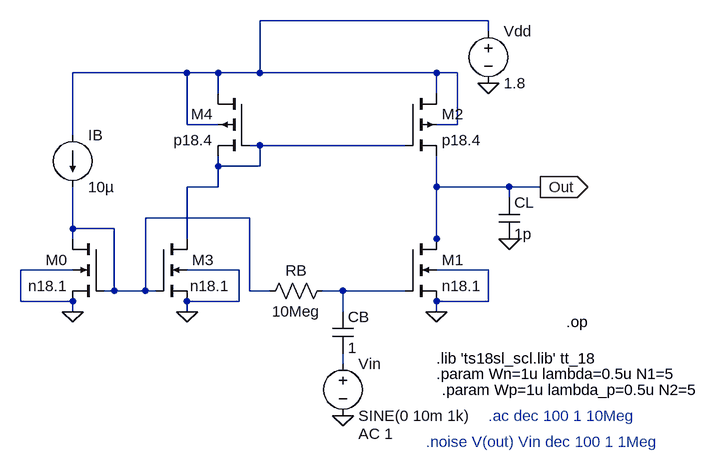
[diagram p0: schematic Q4_copy_1.asc]
Q4_copy_1.asc, the LTspice schematic file:
Version 4.1
SHEET 1 884 680
WIRE 464 -96 112 -96
WIRE 464 -80 464 -96
WIRE 0 -16 -176 -16
WIRE 48 -16 0 -16
WIRE 112 -16 112 -96
WIRE 112 -16 48 -16
WIRE 384 -16 112 -16
WIRE 416 -16 384 -16
WIRE 48 16 48 -16
WIRE 384 16 384 -16
WIRE 0 64 0 -16
WIRE 48 64 0 64
WIRE 416 64 416 -16
WIRE 416 64 384 64
WIRE -176 80 -176 -16
WIRE 112 96 96 96
WIRE 336 96 112 96
WIRE 48 128 48 112
WIRE 112 128 112 96
WIRE 112 128 48 128
WIRE 48 160 48 128
WIRE 48 160 0 160
WIRE 384 160 384 112
WIRE 496 160 384 160
WIRE 544 160 496 160
WIRE 496 176 496 160
WIRE 96 208 -64 208
WIRE -176 224 -176 160
WIRE -112 224 -176 224
WIRE -176 240 -176 224
WIRE 0 240 0 160
WIRE 384 240 384 160
WIRE 384 256 384 240
WIRE -176 288 -256 288
WIRE 80 288 0 288
WIRE 464 288 384 288
WIRE -112 320 -112 224
WIRE -112 320 -128 320
WIRE -64 320 -64 208
WIRE -64 320 -112 320
WIRE -48 320 -64 320
WIRE 96 320 96 208
WIRE 128 320 96 320
WIRE 240 320 208 320
WIRE 336 320 240 320
WIRE -256 336 -256 288
WIRE -176 336 -256 336
WIRE 80 336 80 288
WIRE 80 336 0 336
WIRE 464 336 464 288
WIRE 464 336 384 336
WIRE -176 352 -176 336
WIRE 0 352 0 336
WIRE 240 352 240 320
WIRE 384 352 384 336
WIRE 240 432 240 416
FLAG 464 0 0
FLAG 384 352 0
FLAG 240 512 0
FLAG -176 352 0
FLAG 544 160 Out
IOPIN 544 160 Out
FLAG 496 240 0
FLAG 0 352 0
SYMBOL voltage 464 -96 R0
WINDOW 123 0 0 Left 0
WINDOW 39 0 0 Left 0
SYMATTR InstName Vdd
SYMATTR Value 1.8
SYMBOL nmos4 336 240 R0
SYMATTR InstName M1
SYMATTR Value n18.1
SYMATTR Value2 l={2*lambda} w={N1*Wn} ad={5*lambda*Wn} as={5*lambda*Wn} pd={2*Wn + 10*lambda} ps={2*Wn + 10*lambda}
SYMBOL cap 224 352 R0
SYMATTR InstName CB
SYMATTR Value 1
SYMBOL voltage 240 416 R0
WINDOW 123 24 124 Left 2
WINDOW 39 0 0 Left 0
SYMATTR Value2 AC 1
SYMATTR InstName Vin
SYMATTR Value SINE(0 10m 1k)
SYMBOL res 224 304 R90
WINDOW 0 0 56 VBottom 2
WINDOW 3 32 56 VTop 2
SYMATTR InstName RB
SYMATTR Value 10Meg
SYMBOL nmos4 -128 240 M0
SYMATTR InstName M0
SYMATTR Value n18.1
SYMATTR Value2 l={2*lambda} w={Wn} ad={5*lambda*Wn} as={5*lambda*Wn} pd={2*Wn + 10*lambda} ps={2*Wn + 10*lambda}
SYMBOL current -176 80 R0
WINDOW 123 0 0 Left 0
WINDOW 39 0 0 Left 0
SYMATTR InstName IB
SYMATTR Value 10µ
SYMBOL pmos4 336 16 R0
SYMATTR InstName M2
SYMATTR Value p18.4
SYMATTR Value2 l={2*lambda_p} w={N2*Wp} ad={5*lambda_p*Wp} as={5*lambda_p*Wp} pd={2*Wp + 10*lambda_p} ps={2*Wp + 10*lambda_p}
SYMBOL pmos4 96 16 M0
SYMATTR InstName M4
SYMATTR Value p18.4
SYMATTR Value2 l={2*lambda_p} w={N2*Wp} ad={5*lambda_p*Wp} as={5*lambda_p*Wp} pd={2*Wp + 10*lambda_p} ps={2*Wp + 10*lambda_p}
SYMBOL cap 480 176 R0
SYMATTR InstName CL
SYMATTR Value 1p
SYMBOL nmos4 -48 240 R0
WINDOW 3 53 72 Left 2
SYMATTR Value n18.1
SYMATTR InstName M3
SYMATTR Value2 l={2*lambda} w={N1*Wn} ad={5*lambda*Wn} as={5*lambda*Wn} pd={2*Wn + 10*lambda} ps={2*Wn + 10*lambda}
TEXT 384 448 Left 2 !.param Wn=1u lambda=0.5u N1=5
TEXT 384 424 Left 2 !.lib 'ts18sl_scl.lib' tt_18
TEXT 464 512 Left 2 ;.ac dec 100 1 10Meg
TEXT 392 472 Left 2 !.param Wp=1u lambda_p=0.5u N2=5
TEXT 368 552 Left 2 ;.noise V(out) Vin dec 100 1 1Meg
TEXT 584 368 Left 2 !.op

The netlist it stands for:
* Q4_copy_1.asc
Vdd N001 0 1.8
M1 Out N004 0 0 n18.1 l={2*lambda} w={N1*Wn} ad={5*lambda*Wn} as={5*lambda*Wn} pd={2*Wn + 10*lambda} ps={2*Wn + 10*lambda}
CB N004 N005 1
Vin N005 0 SINE(0 10m 1k) AC 1
RB N004 N003 10Meg
M0 N003 N003 0 0 n18.1 l={2*lambda} w={Wn} ad={5*lambda*Wn} as={5*lambda*Wn} pd={2*Wn + 10*lambda} ps={2*Wn + 10*lambda}
IB N001 N003 10µ
M2 N001 N002 Out N001 p18.4 l={2*lambda_p} w={N2*Wp} ad={5*lambda_p*Wp} as={5*lambda_p*Wp} pd={2*Wp + 10*lambda_p} ps={2*Wp + 10*lambda_p}
M4 N001 N002 N002 N001 p18.4 l={2*lambda_p} w={N2*Wp} ad={5*lambda_p*Wp} as={5*lambda_p*Wp} pd={2*Wp + 10*lambda_p} ps={2*Wp + 10*lambda_p}
CL Out 0 1p
M3 N002 N003 0 0 n18.1 l={2*lambda} w={N1*Wn} ad={5*lambda*Wn} as={5*lambda*Wn} pd={2*Wn + 10*lambda} ps={2*Wn + 10*lambda}
.model NMOS NMOS
.model PMOS PMOS
.lib standard.mos
.param Wn=1u lambda=0.5u N1=5
.lib 'ts18sl_scl.lib' tt_18
* .ac dec 100 1 10Meg
.param Wp=1u lambda_p=0.5u N2=5
* .noise V(out) Vin dec 100 1 1Meg
.op
.backanno
.end